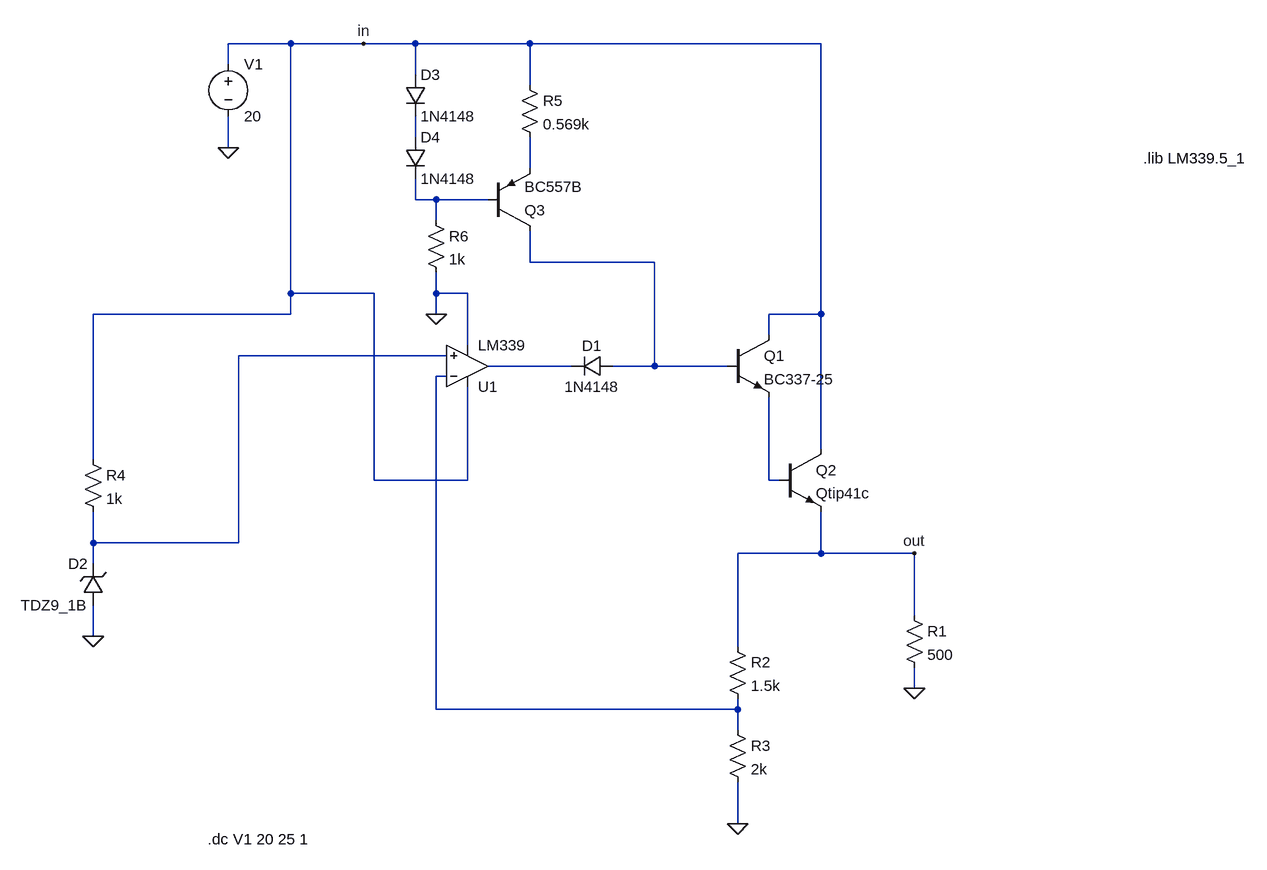
[diagram p0: schematic e2_tp1.asc]
e2_tp1.asc, the LTspice schematic file:
Version 4
SHEET 1 1020 840
WIRE -512 -400 -608 -400
WIRE -400 -400 -512 -400
WIRE -320 -400 -400 -400
WIRE -144 -400 -320 -400
WIRE 304 -400 -144 -400
WIRE -608 -368 -608 -400
WIRE -320 -352 -320 -400
WIRE -144 -336 -144 -400
WIRE -320 -256 -320 -288
WIRE -608 -240 -608 -288
WIRE -144 -208 -144 -256
WIRE -320 -160 -320 -192
WIRE -288 -160 -320 -160
WIRE -208 -160 -288 -160
WIRE -288 -128 -288 -160
WIRE -144 -64 -144 -112
WIRE 48 -64 -144 -64
WIRE -512 -16 -512 -400
WIRE -384 -16 -512 -16
WIRE -288 -16 -288 -48
WIRE -240 -16 -288 -16
WIRE -512 16 -512 -16
WIRE -512 16 -816 16
WIRE -288 16 -288 -16
WIRE 304 16 304 -400
WIRE 304 16 224 16
WIRE 224 48 224 16
WIRE -240 64 -240 -16
WIRE -272 80 -592 80
WIRE -80 96 -208 96
WIRE 48 96 48 -64
WIRE 48 96 -16 96
WIRE 160 96 48 96
WIRE -272 112 -288 112
WIRE 304 224 304 16
WIRE -816 240 -816 16
WIRE -384 272 -384 -16
WIRE -240 272 -240 128
WIRE -240 272 -384 272
WIRE 224 272 224 144
WIRE 240 272 224 272
WIRE -816 368 -816 320
WIRE -592 368 -592 80
WIRE -592 368 -816 368
WIRE 304 384 304 320
WIRE 304 384 176 384
WIRE 448 384 304 384
WIRE -816 400 -816 368
WIRE 448 480 448 384
WIRE -816 512 -816 464
WIRE 176 528 176 384
WIRE 448 592 448 560
WIRE -288 624 -288 112
WIRE 176 624 176 608
WIRE 176 624 -288 624
WIRE 176 656 176 624
WIRE 176 800 176 736
FLAG 448 592 0
FLAG 176 800 0
FLAG -816 512 0
FLAG -400 -400 in
FLAG -608 -240 0
FLAG 448 384 out
FLAG -288 16 0
SYMBOL npn 160 48 R0
SYMATTR InstName Q1
SYMATTR Value BC337-25
SYMBOL npn 240 224 R0
SYMATTR InstName Q2
SYMATTR Value Qtip41c
SYMBOL res 432 464 R0
SYMATTR InstName R1
SYMATTR Value 500
SYMBOL res 160 512 R0
SYMATTR InstName R2
SYMATTR Value 1.5k
SYMBOL res 160 640 R0
SYMATTR InstName R3
SYMATTR Value 2k
SYMBOL diode -16 80 R90
WINDOW 0 0 32 VBottom 2
WINDOW 3 32 32 VTop 2
SYMATTR InstName D1
SYMATTR Value 1N4148
SYMBOL zener -800 464 R180
WINDOW 0 24 64 Left 2
WINDOW 3 24 0 Left 2
SYMATTR InstName D2
SYMATTR Value TDZ9_1B
SYMBOL res -832 224 R0
SYMATTR InstName R4
SYMATTR Value 1k
SYMBOL diode -336 -352 R0
SYMATTR InstName D3
SYMATTR Value 1N4148
SYMBOL diode -336 -256 R0
SYMATTR InstName D4
SYMATTR Value 1N4148
SYMBOL res -160 -352 R0
SYMATTR InstName R5
SYMATTR Value 0.569k
SYMBOL voltage -608 -384 R0
WINDOW 123 0 0 Left 0
WINDOW 39 0 0 Left 0
SYMATTR InstName V1
SYMATTR Value 20
SYMBOL res -304 -144 R0
SYMATTR InstName R6
SYMATTR Value 1k
SYMBOL pnp -208 -112 M180
SYMATTR InstName Q3
SYMATTR Value BC557B
SYMBOL Opamps\\opamp2 -240 160 M180
SYMATTR InstName U1
SYMATTR Value LM339
TEXT -640 824 Left 2 !.dc V1 20 25 1
TEXT 800 -224 Left 2 !.lib LM339.5_1

The netlist it stands for:
* e2_tp1.asc
Q1 in N004 N008 0 BC337-25
Q2 in N008 out 0 Qtip41c
R1 out 0 500
R2 out N007 1.5k
R3 N007 0 2k
D1 N004 N006 1N4148
D2 0 N005 TDZ9_1B
R4 in N005 1k
D3 in N001 1N4148
D4 N001 N003 1N4148
R5 in N002 0.569k
V1 in 0 20
R6 N003 0 1k
Q3 N004 N003 N002 0 BC557B
XU1 N005 N007 in 0 N006 LM339  ; pins In+ In- V+ V- OUT
.model D D
.lib standard.dio
.model NPN NPN
.model PNP PNP
.lib standard.bjt
.dc V1 20 25 1
.lib LM339.5_1
.backanno
.end